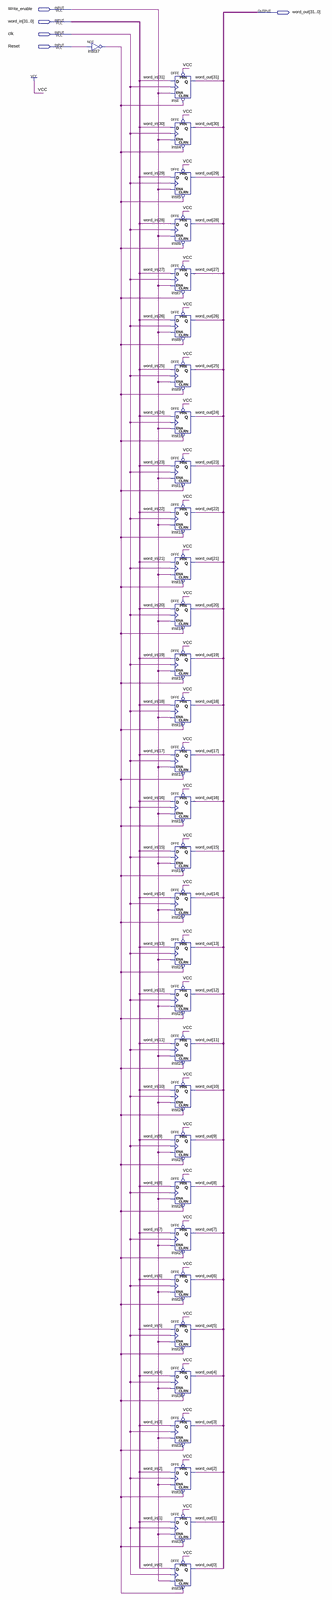
[diagram p0: schematic sheet, whole]
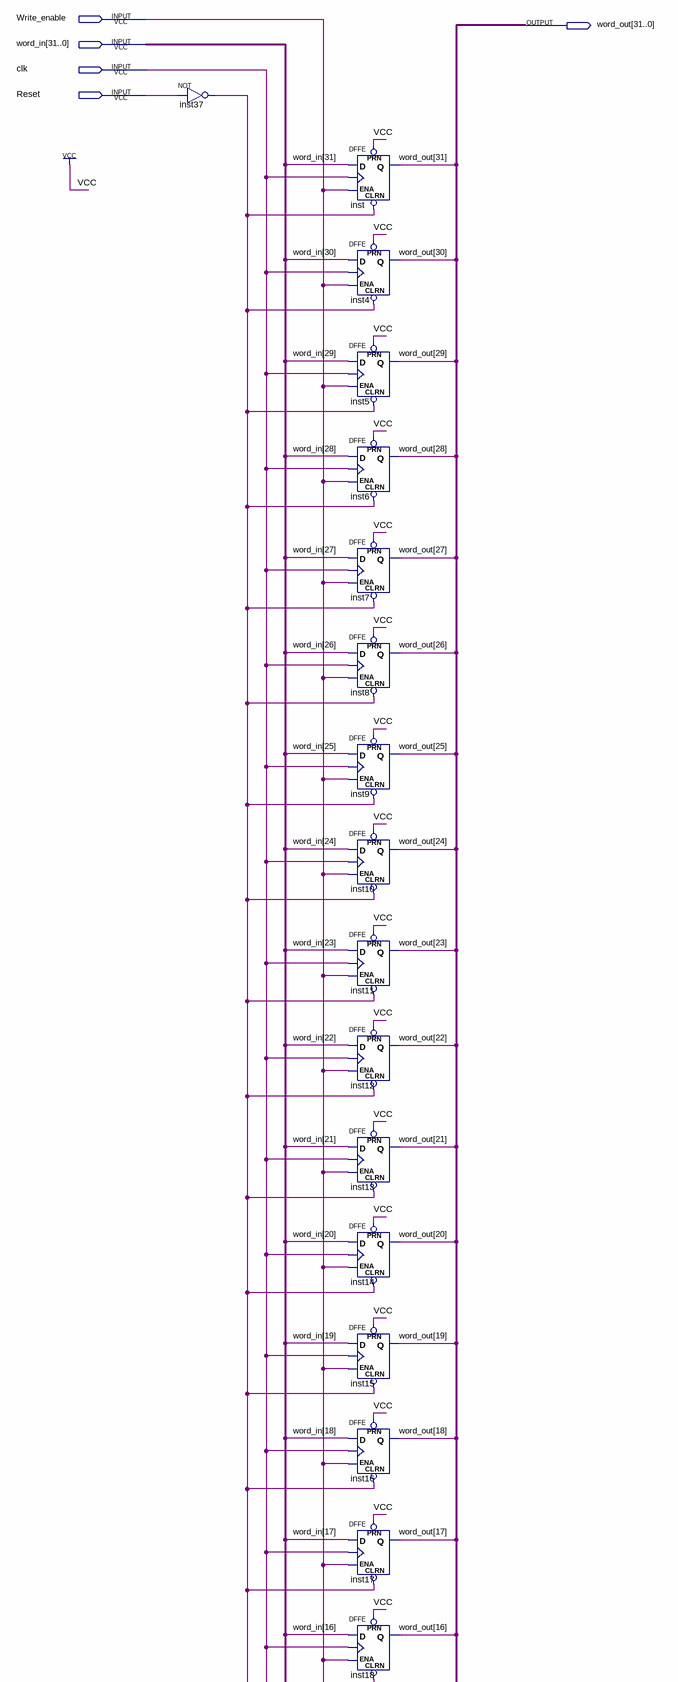
[diagram p1: schematic sheet, upper part]
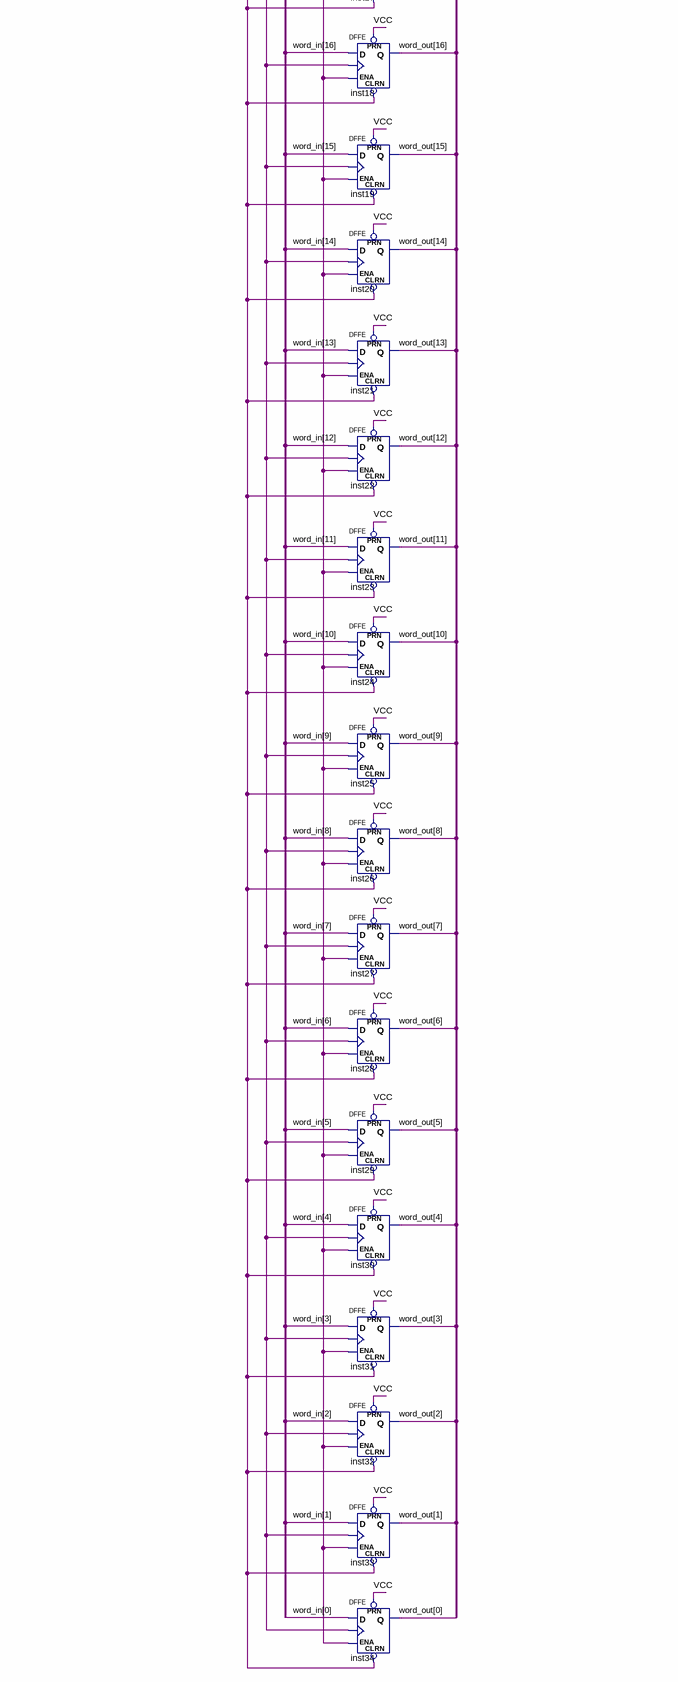
[diagram p2: schematic sheet, lower part]
// Quartus schematic word_register.bdf as structural Verilog: 33 symbols, 5 pins
module word_register (
  input  Write_enable,
  input  [31:0] word_in,
  input  clk,
  input  Reset,
  output [31:0] word_out
);

  wire inst37_out;

  not inst37 (inst37_out, Reset);
  DFFE inst (.PRN(1'b1), .CLRN(inst37_out), .D(word_in[31]), .CLK(clk), .ENA(Write_enable), .Q(word_out[31]));
  DFFE inst4 (.PRN(1'b1), .CLRN(inst37_out), .D(word_in[30]), .CLK(clk), .ENA(Write_enable), .Q(word_out[30]));
  DFFE inst5 (.PRN(1'b1), .CLRN(inst37_out), .D(word_in[29]), .CLK(clk), .ENA(Write_enable), .Q(word_out[29]));
  DFFE inst6 (.PRN(1'b1), .CLRN(inst37_out), .D(word_in[28]), .CLK(clk), .ENA(Write_enable), .Q(word_out[28]));
  DFFE inst7 (.PRN(1'b1), .CLRN(inst37_out), .D(word_in[27]), .CLK(clk), .ENA(Write_enable), .Q(word_out[27]));
  DFFE inst8 (.PRN(1'b1), .CLRN(inst37_out), .D(word_in[26]), .CLK(clk), .ENA(Write_enable), .Q(word_out[26]));
  DFFE inst9 (.PRN(1'b1), .CLRN(inst37_out), .D(word_in[25]), .CLK(clk), .ENA(Write_enable), .Q(word_out[25]));
  DFFE inst10 (.PRN(1'b1), .CLRN(inst37_out), .D(word_in[24]), .CLK(clk), .ENA(Write_enable), .Q(word_out[24]));
  DFFE inst11 (.PRN(1'b1), .CLRN(inst37_out), .D(word_in[23]), .CLK(clk), .ENA(Write_enable), .Q(word_out[23]));
  DFFE inst12 (.PRN(1'b1), .CLRN(inst37_out), .D(word_in[22]), .CLK(clk), .ENA(Write_enable), .Q(word_out[22]));
  DFFE inst13 (.PRN(1'b1), .CLRN(inst37_out), .D(word_in[21]), .CLK(clk), .ENA(Write_enable), .Q(word_out[21]));
  DFFE inst14 (.PRN(1'b1), .CLRN(inst37_out), .D(word_in[20]), .CLK(clk), .ENA(Write_enable), .Q(word_out[20]));
  DFFE inst15 (.PRN(1'b1), .CLRN(inst37_out), .D(word_in[19]), .CLK(clk), .ENA(Write_enable), .Q(word_out[19]));
  DFFE inst16 (.PRN(1'b1), .CLRN(inst37_out), .D(word_in[18]), .CLK(clk), .ENA(Write_enable), .Q(word_out[18]));
  DFFE inst17 (.PRN(1'b1), .CLRN(inst37_out), .D(word_in[17]), .CLK(clk), .ENA(Write_enable), .Q(word_out[17]));
  DFFE inst18 (.PRN(1'b1), .CLRN(inst37_out), .D(word_in[16]), .CLK(clk), .ENA(Write_enable), .Q(word_out[16]));
  DFFE inst19 (.PRN(1'b1), .CLRN(inst37_out), .D(word_in[15]), .CLK(clk), .ENA(Write_enable), .Q(word_out[15]));
  DFFE inst20 (.PRN(1'b1), .CLRN(inst37_out), .D(word_in[14]), .CLK(clk), .ENA(Write_enable), .Q(word_out[14]));
  DFFE inst21 (.PRN(1'b1), .CLRN(inst37_out), .D(word_in[13]), .CLK(clk), .ENA(Write_enable), .Q(word_out[13]));
  DFFE inst22 (.PRN(1'b1), .CLRN(inst37_out), .D(word_in[12]), .CLK(clk), .ENA(Write_enable), .Q(word_out[12]));
  DFFE inst23 (.PRN(1'b1), .CLRN(inst37_out), .D(word_in[11]), .CLK(clk), .ENA(Write_enable), .Q(word_out[11]));
  DFFE inst24 (.PRN(1'b1), .CLRN(inst37_out), .D(word_in[10]), .CLK(clk), .ENA(Write_enable), .Q(word_out[10]));
  DFFE inst25 (.PRN(1'b1), .CLRN(inst37_out), .D(word_in[9]), .CLK(clk), .ENA(Write_enable), .Q(word_out[9]));
  DFFE inst26 (.PRN(1'b1), .CLRN(inst37_out), .D(word_in[8]), .CLK(clk), .ENA(Write_enable), .Q(word_out[8]));
  DFFE inst27 (.PRN(1'b1), .CLRN(inst37_out), .D(word_in[7]), .CLK(clk), .ENA(Write_enable), .Q(word_out[7]));
  DFFE inst28 (.PRN(1'b1), .CLRN(inst37_out), .D(word_in[6]), .CLK(clk), .ENA(Write_enable), .Q(word_out[6]));
  DFFE inst29 (.PRN(1'b1), .CLRN(inst37_out), .D(word_in[5]), .CLK(clk), .ENA(Write_enable), .Q(word_out[5]));
  DFFE inst30 (.PRN(1'b1), .CLRN(inst37_out), .D(word_in[4]), .CLK(clk), .ENA(Write_enable), .Q(word_out[4]));
  DFFE inst31 (.PRN(1'b1), .CLRN(inst37_out), .D(word_in[3]), .CLK(clk), .ENA(Write_enable), .Q(word_out[3]));
  DFFE inst32 (.PRN(1'b1), .CLRN(inst37_out), .D(word_in[2]), .CLK(clk), .ENA(Write_enable), .Q(word_out[2]));
  DFFE inst33 (.PRN(1'b1), .CLRN(inst37_out), .D(word_in[1]), .CLK(clk), .ENA(Write_enable), .Q(word_out[1]));
  DFFE inst34 (.PRN(1'b1), .CLRN(inst37_out), .D(word_in[0]), .CLK(clk), .ENA(Write_enable), .Q(word_out[0]));
endmodule
